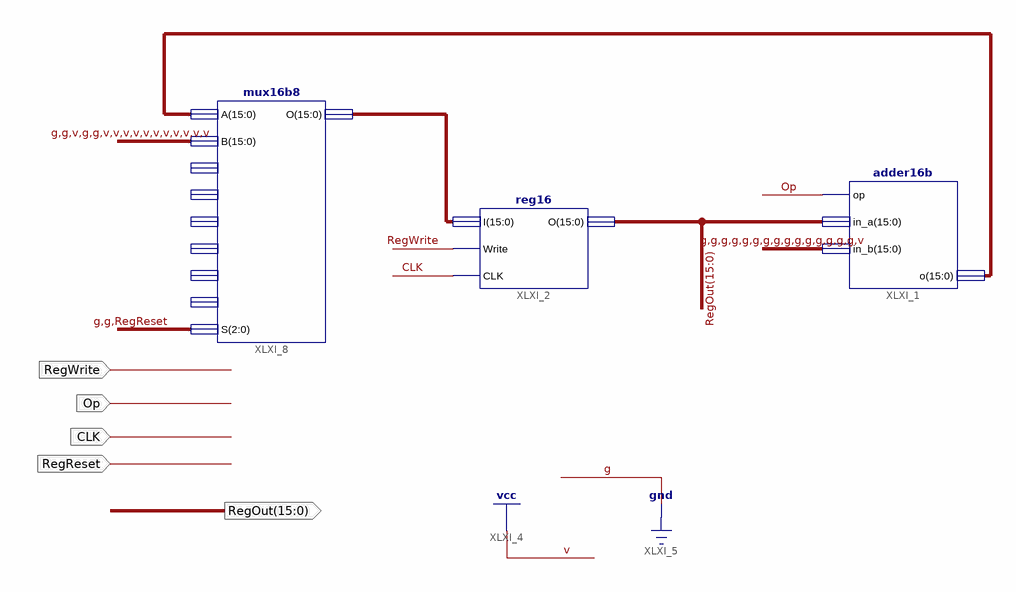
[diagram p0: schematic sheet 1]
// Xilinx ISE schematic stage1RSPIncrementer.sch (spartan3e) as structural Verilog: 3 symbols, 5 ports
module stage1RSPIncrementer (
  input  RegWrite,
  input  Op,
  input  CLK,
  input  RegReset,
  output [15:0] RegOut
);

  wire g;
  wire [15:0] XLXN_30, XLXN_31;

  adder16b XLXI_1 (.op(Op), .in_a(RegOut), .in_b({{15{g}}, 1'b1}), .o(XLXN_31));
  reg16 XLXI_2 (.I(XLXN_30), .Write(RegWrite), .CLK(CLK), .O(RegOut));
  mux16b8 XLXI_8 (
    .A(XLXN_31), .B({{2{g}}, 1'b1, {2{g}}, {11{1'b1}}}), .S({{2{g}}, RegReset}), .O(XLXN_30));  // open: C, D, E, F, G, H
  // also tied to GND on the sheet: g
endmodule
